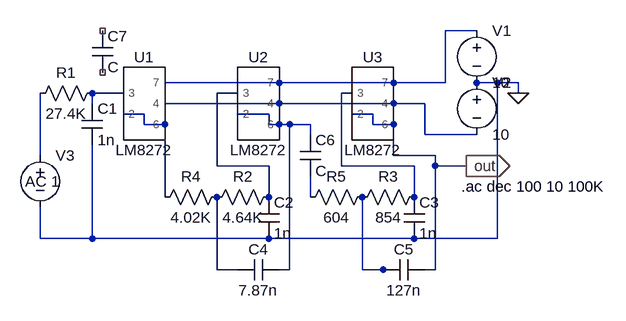
[diagram p0: schematic THINK_TI.asc]
THINK_TI.asc, the LTspice schematic file:
Version 4
SHEET 1 1020 680
WIRE 608 32 560 32
WIRE 304 112 128 112
WIRE 480 112 304 112
WIRE 560 112 560 32
WIRE 560 112 480 112
WIRE 640 112 608 112
WIRE 672 112 640 112
WIRE 64 128 16 128
WIRE 240 128 208 128
WIRE 416 128 400 128
WIRE 672 128 672 112
WIRE 16 144 16 128
WIRE 304 144 128 144
WIRE 480 144 304 144
WIRE 528 144 480 144
WIRE 96 160 64 160
WIRE 288 160 240 160
WIRE 448 160 416 160
WIRE 96 176 96 160
WIRE 128 176 96 176
WIRE 288 176 288 160
WIRE 304 176 288 176
WIRE 320 176 304 176
WIRE 352 176 320 176
WIRE 448 176 448 160
WIRE 480 176 448 176
WIRE 352 192 352 176
WIRE 528 192 528 144
WIRE 608 192 528 192
WIRE -64 224 -64 128
WIRE 480 224 480 176
WIRE 544 224 480 224
WIRE 208 240 208 128
WIRE 288 240 208 240
WIRE 400 240 400 128
WIRE 512 240 400 240
WIRE 544 240 544 224
WIRE 592 240 544 240
WIRE 128 288 128 176
WIRE 288 288 288 240
WIRE 352 288 352 256
WIRE 512 288 512 240
WIRE -64 352 -64 304
WIRE 16 352 16 208
WIRE 16 352 -64 352
WIRE 288 352 16 352
WIRE 512 352 288 352
WIRE 640 352 640 112
WIRE 640 352 512 352
WIRE 208 400 208 288
WIRE 240 400 208 400
WIRE 320 400 320 176
WIRE 320 400 304 400
WIRE 432 400 432 288
WIRE 464 400 432 400
WIRE 480 400 464 400
WIRE 544 400 544 240
WIRE 544 400 528 400
FLAG 672 128 0
FLAG 592 240 out
IOPIN 592 240 Out
SYMBOL voltage 608 16 R0
WINDOW 123 0 0 Left 0
WINDOW 39 0 0 Left 0
SYMATTR InstName V1
SYMATTR Value 10
SYMBOL voltage 608 96 R0
WINDOW 123 0 0 Left 0
WINDOW 39 0 0 Left 0
SYMATTR InstName V2
SYMATTR Value 10
SYMBOL res 32 112 R90
WINDOW 0 0 56 VBottom 2
WINDOW 3 32 56 VTop 2
SYMATTR InstName R1
SYMATTR Value 27.4K
SYMBOL res 304 272 R90
WINDOW 0 0 56 VBottom 2
WINDOW 3 32 56 VTop 2
SYMATTR InstName R2
SYMATTR Value 4.64K
SYMBOL res 528 272 R90
WINDOW 0 0 56 VBottom 2
WINDOW 3 32 56 VTop 2
SYMATTR InstName R3
SYMATTR Value 854
SYMBOL cap 0 144 R0
SYMATTR InstName C1
SYMATTR Value 1n
SYMBOL cap 272 288 R0
SYMATTR InstName C2
SYMATTR Value 1n
SYMBOL cap 496 288 R0
SYMATTR InstName C3
SYMATTR Value 1n
SYMBOL res 224 272 R90
WINDOW 0 0 56 VBottom 2
WINDOW 3 32 56 VTop 2
SYMATTR InstName R4
SYMATTR Value 4.02K
SYMBOL res 336 304 R270
WINDOW 0 32 56 VTop 2
WINDOW 3 0 56 VBottom 2
SYMATTR InstName R5
SYMATTR Value 604
SYMBOL cap 304 384 R90
WINDOW 0 0 32 VBottom 2
WINDOW 3 32 32 VTop 2
SYMATTR InstName C4
SYMATTR Value 7.87n
SYMBOL cap 528 384 R90
WINDOW 0 0 32 VBottom 2
WINDOW 3 32 32 VTop 2
SYMATTR InstName C5
SYMATTR Value 127n
SYMBOL voltage -64 208 R0
WINDOW 123 -23 56 Left 2
WINDOW 39 0 0 Left 0
SYMATTR Value2 AC 1
SYMATTR InstName V3
SYMATTR Value ""
SYMBOL LM8272 96 144 R0
SYMATTR InstName U1
SYMBOL LM8272 272 144 R0
SYMATTR InstName U2
SYMBOL LM8272 448 144 R0
SYMATTR InstName U3
SYMBOL cap 336 192 R0
SYMATTR InstName C6
SYMBOL cap 16 32 R0
SYMATTR InstName C7
TEXT 584 272 Left 2 !.ac dec 100 10 100K

The netlist it stands for:
* THINK_TI.asc
V1 N001 0 10
V2 0 N005 10
R1 N002 N008 27.4K
R2 N003 N010 4.64K
R3 N004 N011 854
C1 N002 0 1n
C2 N003 0 1n
C3 N004 0 1n
R4 N010 N006 4.02K
R5 N009 N011 604
C4 N007 N010 7.87n
C5 out N011 127n
V3 N008 0 AC 1
XU1 N002 N006 N001 N005 N006 LM8272  ; pins 3 2 7 4 6
XU2 N003 N007 N001 N005 N007 LM8272  ; pins 3 2 7 4 6
XU3 N004 out N001 N005 out LM8272  ; pins 3 2 7 4 6
C6 N007 N009 C
C7 NC_01 NC_02 C
.ac dec 100 10 100K
.lib D:\Êý¾Ý\wendang\Ñ§Ï°\ÏÖ\Ä£µçÊµÑé\LM8272.MOD
.backanno
.end